# EAGLE schematic Interface_R1-0 (EAGLE 7.2.0)
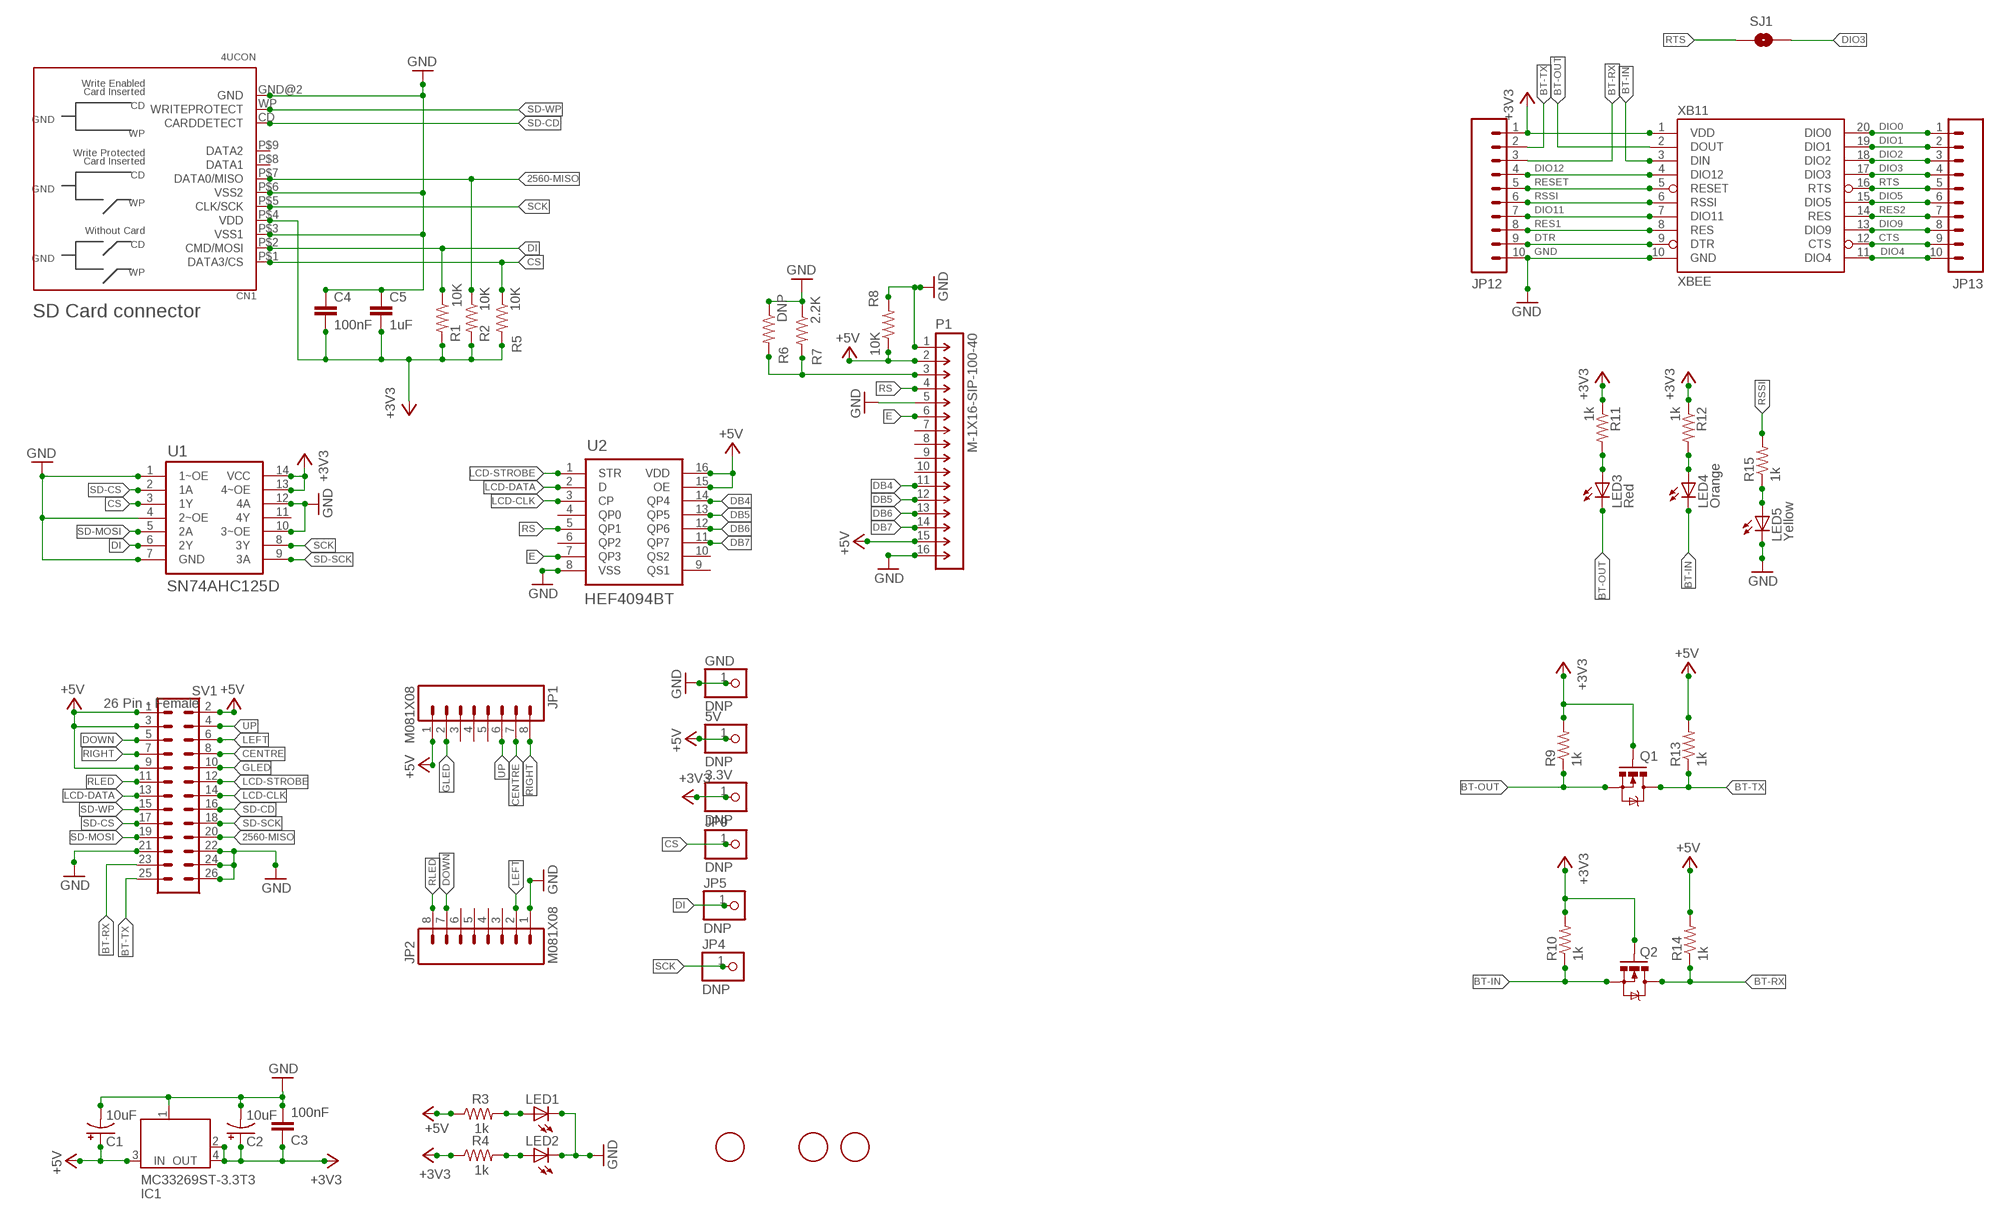
[diagram p0: schematic, sheet 1]

## Parts
3.3V  DNP  PINHD-1X1  [1X01]
5V  DNP  PINHD-1X1  [1X01]
C1  10uF  CAP_POL1206  [EIA3216]
C2  10uF  CAP_POL1206  [EIA3216]
C3  100nF  CAP0805  [0805]
C4  100nF  CAP0805  [0805]
C5  1uF  CAP0805  [0805]
CN1  4UCON  SDCARD19646  [SDCARD_SMT_4U19646]
GND  DNP  PINHD-1X1  [1X01]
IC1  MC33269ST-3.3T3  [SOT223]
JP1  M081X08  [1X08]
JP2  M081X08  [1X08]
JP3  FIDUCIAL1.5X3  [FIDUCIAL-1.5X3]
JP4  DNP  PINHD-1X1  [1X01]
JP5  DNP  PINHD-1X1  [1X01]
JP9  DNP  PINHD-1X1  [1X01]
JP10  FIDUCIAL1.5X3  [FIDUCIAL-1.5X3]
JP11  FIDUCIAL1.5X3  [FIDUCIAL-1.5X3]
JP12  M100.1  [1X10]
JP13  M100.1  [1X10]
LED1  GREEN  LED0805  [LED-0805]
LED2  Blue  LED0805  [LED-0805]
LED3  Red  LED0805  [LED-0805]
LED4  Orange  LED0805  [LED-0805]
LED5  Yellow  LED0805  [LED-0805]
P1  M-1X16-SIP-100-40  [SIP-100-16-40]
Q1  MOSFET-NCHANNELSMD  [SOT23-3]
Q2  MOSFET-NCHANNELSMD  [SOT23-3]
R1  10K  RESISTOR  [0805]
R2  10K  RESISTOR  [0805]
R3  1k  RESISTOR  [0805]
R4  1k  RESISTOR  [0805]
R5  10K  RESISTOR  [0805]
R6  DNP  RESISTOR  [0805]
R7  2.2K  RESISTOR  [0805]
R8  10K  RESISTOR  [0805]
R9  1k  RESISTOR  [0805]
R10  1k  RESISTOR  [0805]
R11  1k  RESISTOR  [0805]
R12  1k  RESISTOR  [0805]
R13  1k  RESISTOR  [0805]
R14  1k  RESISTOR  [0805]
R15  1k  RESISTOR  [0805]
SJ1  SOLDERJUMPERNO  [SJ_2S-NO]
SV1  26 Pin - Female  ML26  [ML26]
U1  SN74AHC125D  [SOIC127P600X175-14N]
U2  HEF4094BT  [SOIC127P600X175-16N]
XB11  XBEE  XBEE-1B2  [XBEE-SILK]

## Nets
2560-MISO: CN1.P$7(DATA0/MISO) R2.1 SV1.20
+3V3: 3.3V.1 C2.A(+) C3.1 C4.2 C5.2 CN1.P$4(VDD) IC1.2(OUT) IC1.4(OUT) JP12.1 Q1.1(G) Q2.1(G) R1.2 R2.2 R4.1 R5.2 R9.2 R10.2 R11.1 R12.1 U1.13(4~OE) U1.14(VCC) XB11.1(VDD)
+5V: 5V.1 C1.A(+) IC1.3(IN) JP1.1 P1.2 P1.15 R3.1 R8.1 R13.2 R14.2 SV1.1 SV1.2 SV1.3 SV1.9 U2.15(OE) U2.16(VDD)
BT-IN: LED4.C Q2.2(S) R10.1 XB11.3(DIN)
BT-OUT: LED3.C Q1.2(S) R9.1 XB11.2(DOUT)
BT-RX: JP12.3 Q2.3(D) R14.1 SV1.23
BT-TX: JP12.2 Q1.3(D) R13.1 SV1.25
CENTRE: JP1.7 SV1.8
CS: CN1.P$1(DATA3/CS) JP9.1 R5.1 U1.3(1Y)
CTS: JP13.9 XB11.12(CTS)
DB4: P1.11 U2.14(QP4)
DB5: P1.12 U2.13(QP5)
DB6: P1.13 U2.12(QP6)
DB7: P1.14 U2.11(QP7)
DI: CN1.P$2(CMD/MOSI) JP5.1 R1.1 U1.6(2Y)
DIO0: JP13.1 XB11.20(DIO0)
DIO1: JP13.2 XB11.19(DIO1)
DIO2: JP13.3 XB11.18(DIO2)
DIO3: JP13.4 SJ1.2 XB11.17(DIO3)
DIO4: JP13.10 XB11.11(DIO4)
DIO5: JP13.6 XB11.15(DIO5)
DIO9: JP13.8 XB11.13(DIO9)
DIO11: JP12.7 XB11.7(DIO11)
DIO12: JP12.4 XB11.4(DIO12)
DOWN: JP2.7 SV1.5
DTR: JP12.9 XB11.9(DTR)
E: P1.6 U2.7(QP3)
GLED: JP1.2 SV1.10
GND: C1.C(-) C2.C(-) C3.2 C4.1 C5.1 CN1.GND@2(GND) CN1.P$3(VSS1) CN1.P$6(VSS2) GND.1 IC1.1(GND/ADJ) JP2.1 JP12.10 LED1.C LED2.C LED5.C P1.1 P1.5 P1.16 R6.1 R7.1 R8.2 SV1.21 SV1.22 SV1.24 SV1.26 U1.1(1~OE) U1.4(2~OE) U1.7(GND) U1.10(3~OE) U1.12(4A) U2.8(VSS) XB11.10(GND)
LCD-CLK: SV1.14 U2.3(CP)
LCD-DATA: SV1.13 U2.2(D)
LCD-STROBE: SV1.12 U2.1(STR)
LEFT: JP2.2 SV1.6
N$3: LED1.A R3.2
N$4: LED2.A R4.2
N$468: LED3.A R11.2
N$469: LED4.A R12.2
N$470: LED5.A R15.1
N$1062: P1.3 R6.2 R7.2
RES1: JP12.8 XB11.8(RES)
RES2: JP13.7 XB11.14(RES)
RESET: JP12.5 XB11.5(RESET)
RIGHT: JP1.8 SV1.7
RLED: JP2.8 SV1.11
RS: P1.4 U2.5(QP1)
RSSI: JP12.6 R15.2 XB11.6(RSSI)
RTS: JP13.5 SJ1.1 XB11.16(RTS)
SCK: CN1.P$5(CLK/SCK) JP4.1 U1.8(3Y)
SD-CD: CN1.CD(CARDDETECT) SV1.16
SD-CS: SV1.17 U1.2(1A)
SD-MOSI: SV1.19 U1.5(2A)
SD-SCK: SV1.18 U1.9(3A)
SD-WP: CN1.WP(WRITEPROTECT) SV1.15
UP: JP1.6 SV1.4
Unconnected: CN1.P$8(DATA1) CN1.P$9(DATA2) JP1.3 JP1.4 JP1.5 JP2.3 JP2.4 JP2.5 JP2.6 P1.7 P1.8 P1.9 P1.10 U1.11(4Y) U2.4(QP0) U2.6(QP2) U2.9(QS1) U2.10(QS2)

## Notes on the sheet
- SD Card connector

## Library data of the parts
3.3V 5V GND JP4 JP5 JP9 = CB_R2:PINHD-1X1: PIN HEADER
C1 C2 = SparkFun:CAP_POL: Capacitor Polarized These are standard SMD and PTH capacitors. Normally 10uF, 47uF, and 100uF in electrolytic and tantalum varieties. Always verify the external diameter of the through hole cap, it varies with capacity, voltage, and manufacturer. The EIA devices should be standard.
C3-C5 = SparkFun-Capacitors:CAP: Capacitor Standard 0603 ceramic capacitor, and 0.1" leaded capacitor.
CN1 = microbuilder:SDCARD: SD Card Reader 06132 = Inexpensive SMT 19646 = Push/Pull SMT
IC1 = linear:MC33269ST*: Adjustable Output Low Dropout Voltage Regulator 800 mA Source: http://www.onsemi.com/pub/Collateral/MC33269-D.PDF
JP1 JP2 = SparkFun (2):M08: Header 8 Standard 8-pin 0.1" header. Use with straight break away headers (SKU : PRT-00116), right angle break away headers (PRT-00553), swiss pins (PRT-00743), machine pins (PRT-00117), and female headers (PRT-00115).
JP3 JP10 JP11 = CB_Main:FIDUCIAL: Fiducial Alignment Points Various fiducial points for machine vision alignment.
JP12 JP13 = SparkFun:M10: Header 10 Standard 10-pin 0.1" header. Use with straight break away headers (SKU : PRT-00116), right angle break away headers (PRT-00553), swiss pins (PRT-00743), machine pins (PRT-00117), and female headers (PRT-00115).
LED1-LED5 = CB_Main:LED: LEDs Standard schematic elements and footprints for 5mm, 3mm, 1206, and 0603 sized LEDs. 5mm - Spark Fun Electronics SKU : COM-00529 (and others)
P1 = con-headers-jp:M-1X16-: MALE HEADER
Q1 Q2 = SparkFun-DiscreteSemi:MOSFET-NCHANNEL: Generic NMOS footprint
R1-R15 = CB_Main:RESISTOR: Resistor Basic schematic elements and footprints for 0603, 1206, and PTH 1/10th watt (small) resistors.
SJ1 = SparkFun:SOLDERJUMPER: Solder Jumper Standard SMD solder jumper. Used to automate production. Two varients : Normally Open and Normally Closed are the same, but have different paste layers. NC will have a large amount of paste and should jumper during reflow.
SV1 = con-harting-ml:ML26: HARTING; OC_FARNELL: unknown; OC_NEWARK: unknown
U1 = 1untitled:SN74AHC125D: QUAD BUS BUFFER GATE; MPN: SN74AHC125D; OC_FARNELL: 1470770; OC_NEWARK: 76C1740; PACKAGE: 14-SOIC; SUPPLIER: Texas Instruments
U2 = 1untitled:HEF4094BT: 8-stage shift-and-store register; MPN: HHEF4094BT; OC_FARNELL: 1201297; OC_NEWARK: 25M9623; PACKAGE: SOIC-16; SUPPLIER: NXP
XB11 = CB_Main:XBEE-1

## Net classes
0 default: width 0.203 mm, drill 0.406 mm, clearance 0.178 mm
1 24V: width 0.889 mm, drill 0.635 mm, clearance 0.508 mm